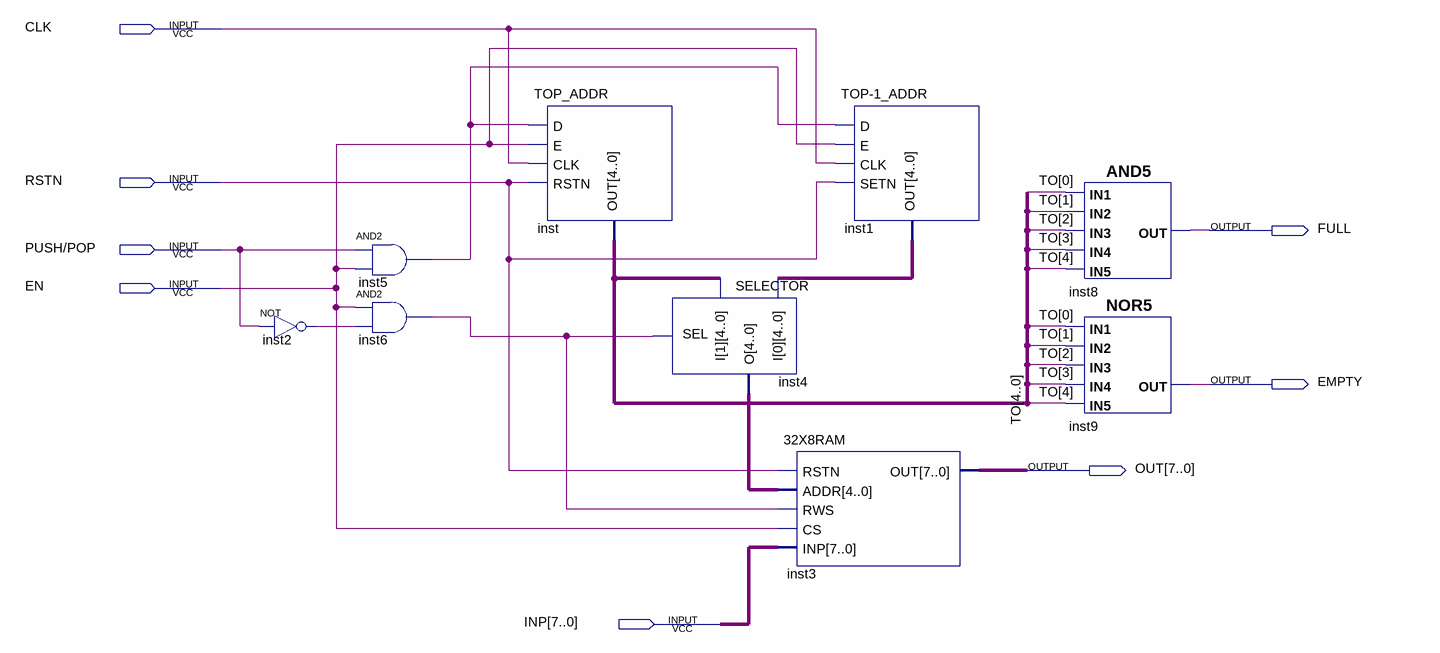
[diagram p0: schematic sheet]
// Quartus schematic STACK.bdf as structural Verilog: 9 symbols, 8 pins
module STACK (
  input  CLK,
  input  RSTN,
  input  \PUSH/POP ,
  input  EN,
  input  [7:0] INP,
  output FULL,
  output EMPTY,
  output [7:0] OUT
);

  wire inst2_out, inst5_out, inst6_out;
  wire [4:0] inst1_out, inst4_o, TO;

  not inst2 (inst2_out, \PUSH/POP );
  and inst5 (inst5_out, \PUSH/POP , EN);
  and inst6 (inst6_out, EN, inst2_out);
  TOP_ADDR inst (.D(inst5_out), .E(EN), .CLK(CLK), .RSTN(RSTN), .OUT(TO));
  SELECTOR inst4 (.SEL(inst6_out), .I_0(inst1_out), .I_1(TO), .O(inst4_o));
  \TOP-1_ADDR  inst1 (.D(inst5_out), .E(EN), .CLK(CLK), .SETN(RSTN), .OUT(inst1_out));
  \32X8RAM  inst3 (.RSTN(RSTN), .ADDR(inst4_o), .RWS(inst6_out), .CS(EN), .INP(INP), .OUT(OUT));
  and inst8 (FULL, TO[0], TO[1], TO[2], TO[3], TO[4]);
  nor inst9 (EMPTY, TO[0], TO[1], TO[2], TO[3], TO[4]);
endmodule
